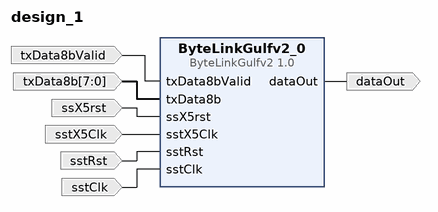
[diagram p0: block diagram of the top level]
# Vivado block design design_1, xc7z020clg400-1, Vivado 2018.2
create_bd_design design_1

create_bd_port -dir I sstClk
create_bd_port -dir I sstRst
create_bd_port -dir I sstX5Clk
create_bd_port -dir I ssX5rst
create_bd_port -dir I -from 7 -to 0 txData8b
create_bd_port -dir I txData8bValid
create_bd_port -dir O dataOut

create_bd_cell -type ip -vlnv xilinx.com:user:ByteLinkGulfv2:1.0 ByteLinkGulfv2_0

# ---- connections ----

connect_bd_net [get_bd_ports txData8bValid] [get_bd_pins ByteLinkGulfv2_0/txData8bValid]
connect_bd_net [get_bd_ports txData8b] [get_bd_pins ByteLinkGulfv2_0/txData8b]
connect_bd_net [get_bd_ports ssX5rst] [get_bd_pins ByteLinkGulfv2_0/ssX5rst]
connect_bd_net [get_bd_ports sstX5Clk] [get_bd_pins ByteLinkGulfv2_0/sstX5Clk]
connect_bd_net [get_bd_ports sstRst] [get_bd_pins ByteLinkGulfv2_0/sstRst]
connect_bd_net [get_bd_ports sstClk] [get_bd_pins ByteLinkGulfv2_0/sstClk]
connect_bd_net [get_bd_pins ByteLinkGulfv2_0/dataOut] [get_bd_ports dataOut]

validate_bd_design
save_bd_design
